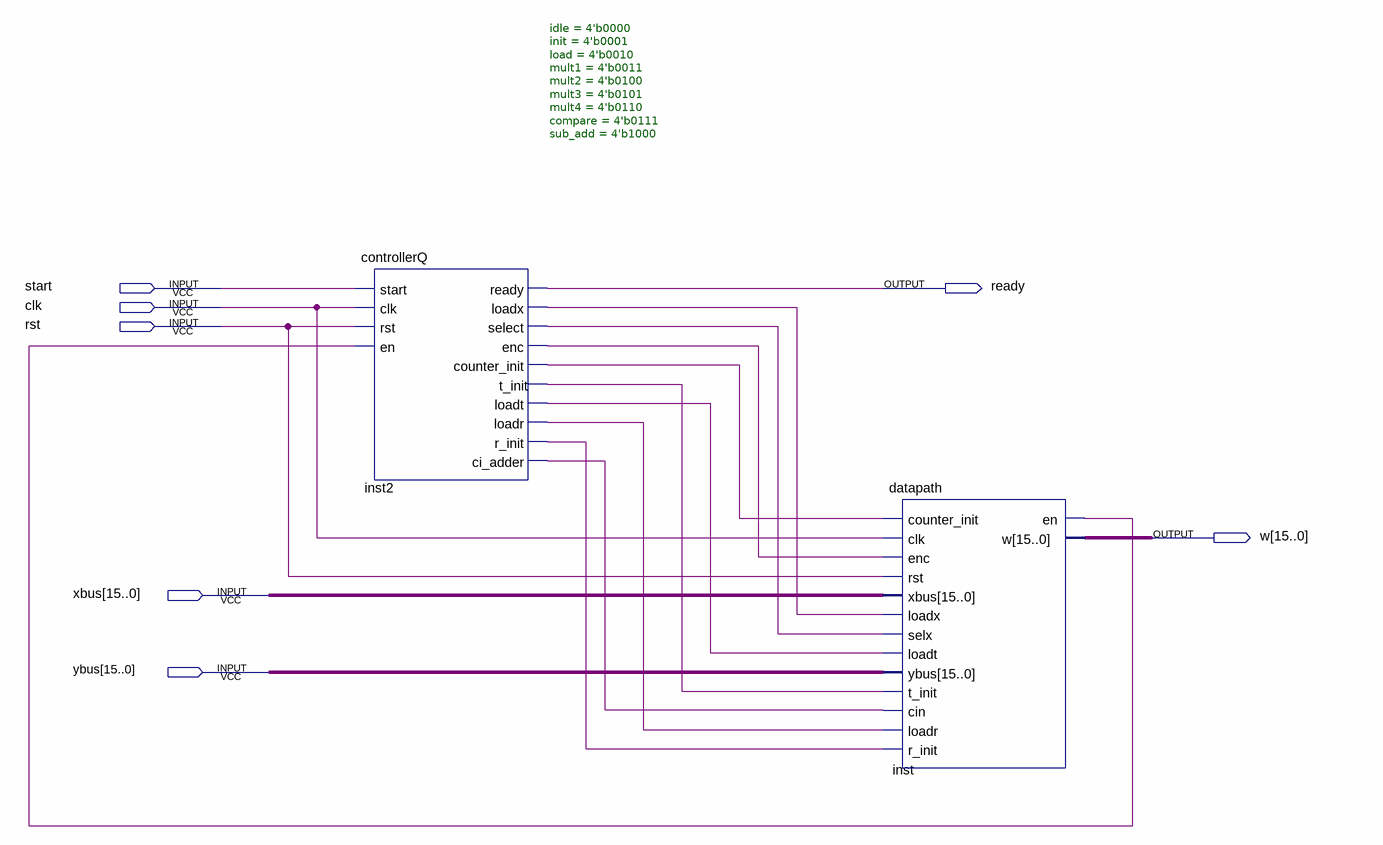
[diagram p0: schematic sheet]
// Quartus schematic final.bdf as structural Verilog: 2 symbols, 7 pins
module \final  (
  input  start,
  input  clk,
  input  rst,
  input  [15:0] xbus,
  input  [15:0] ybus,
  output ready,
  output [15:0] w
);

  wire inst2_ci_adder, inst2_counter_init, inst2_enc, inst2_loadr, inst2_loadt, inst2_loadx, inst2_r_init,
       inst2_select, inst2_t_init, inst_en;

  controllerQ #(.idle(4'b0000), .init(4'b0001), .load(4'b0010), .mult1(4'b0011), .mult2(4'b0100), .mult3(4'b0101), .mult4(4'b0110), .compare(4'b0111), .sub_add(4'b1000)) inst2 (
    .start(start), .clk(clk), .rst(rst), .en(inst_en), .ready(ready), .loadx(inst2_loadx),
    .select(inst2_select), .enc(inst2_enc), .counter_init(inst2_counter_init), .t_init(inst2_t_init),
    .loadt(inst2_loadt), .loadr(inst2_loadr), .r_init(inst2_r_init), .ci_adder(inst2_ci_adder));
  datapath inst (
    .counter_init(inst2_counter_init), .clk(clk), .enc(inst2_enc), .rst(rst), .xbus(xbus),
    .loadx(inst2_loadx), .selx(inst2_select), .loadt(inst2_loadt), .ybus(ybus), .t_init(inst2_t_init),
    .cin(inst2_ci_adder), .loadr(inst2_loadr), .r_init(inst2_r_init), .en(inst_en), .w(w));
endmodule
